# EAGLE design H0FR70 (EAGLE 9.6.1)

## Sheet 1 of 2
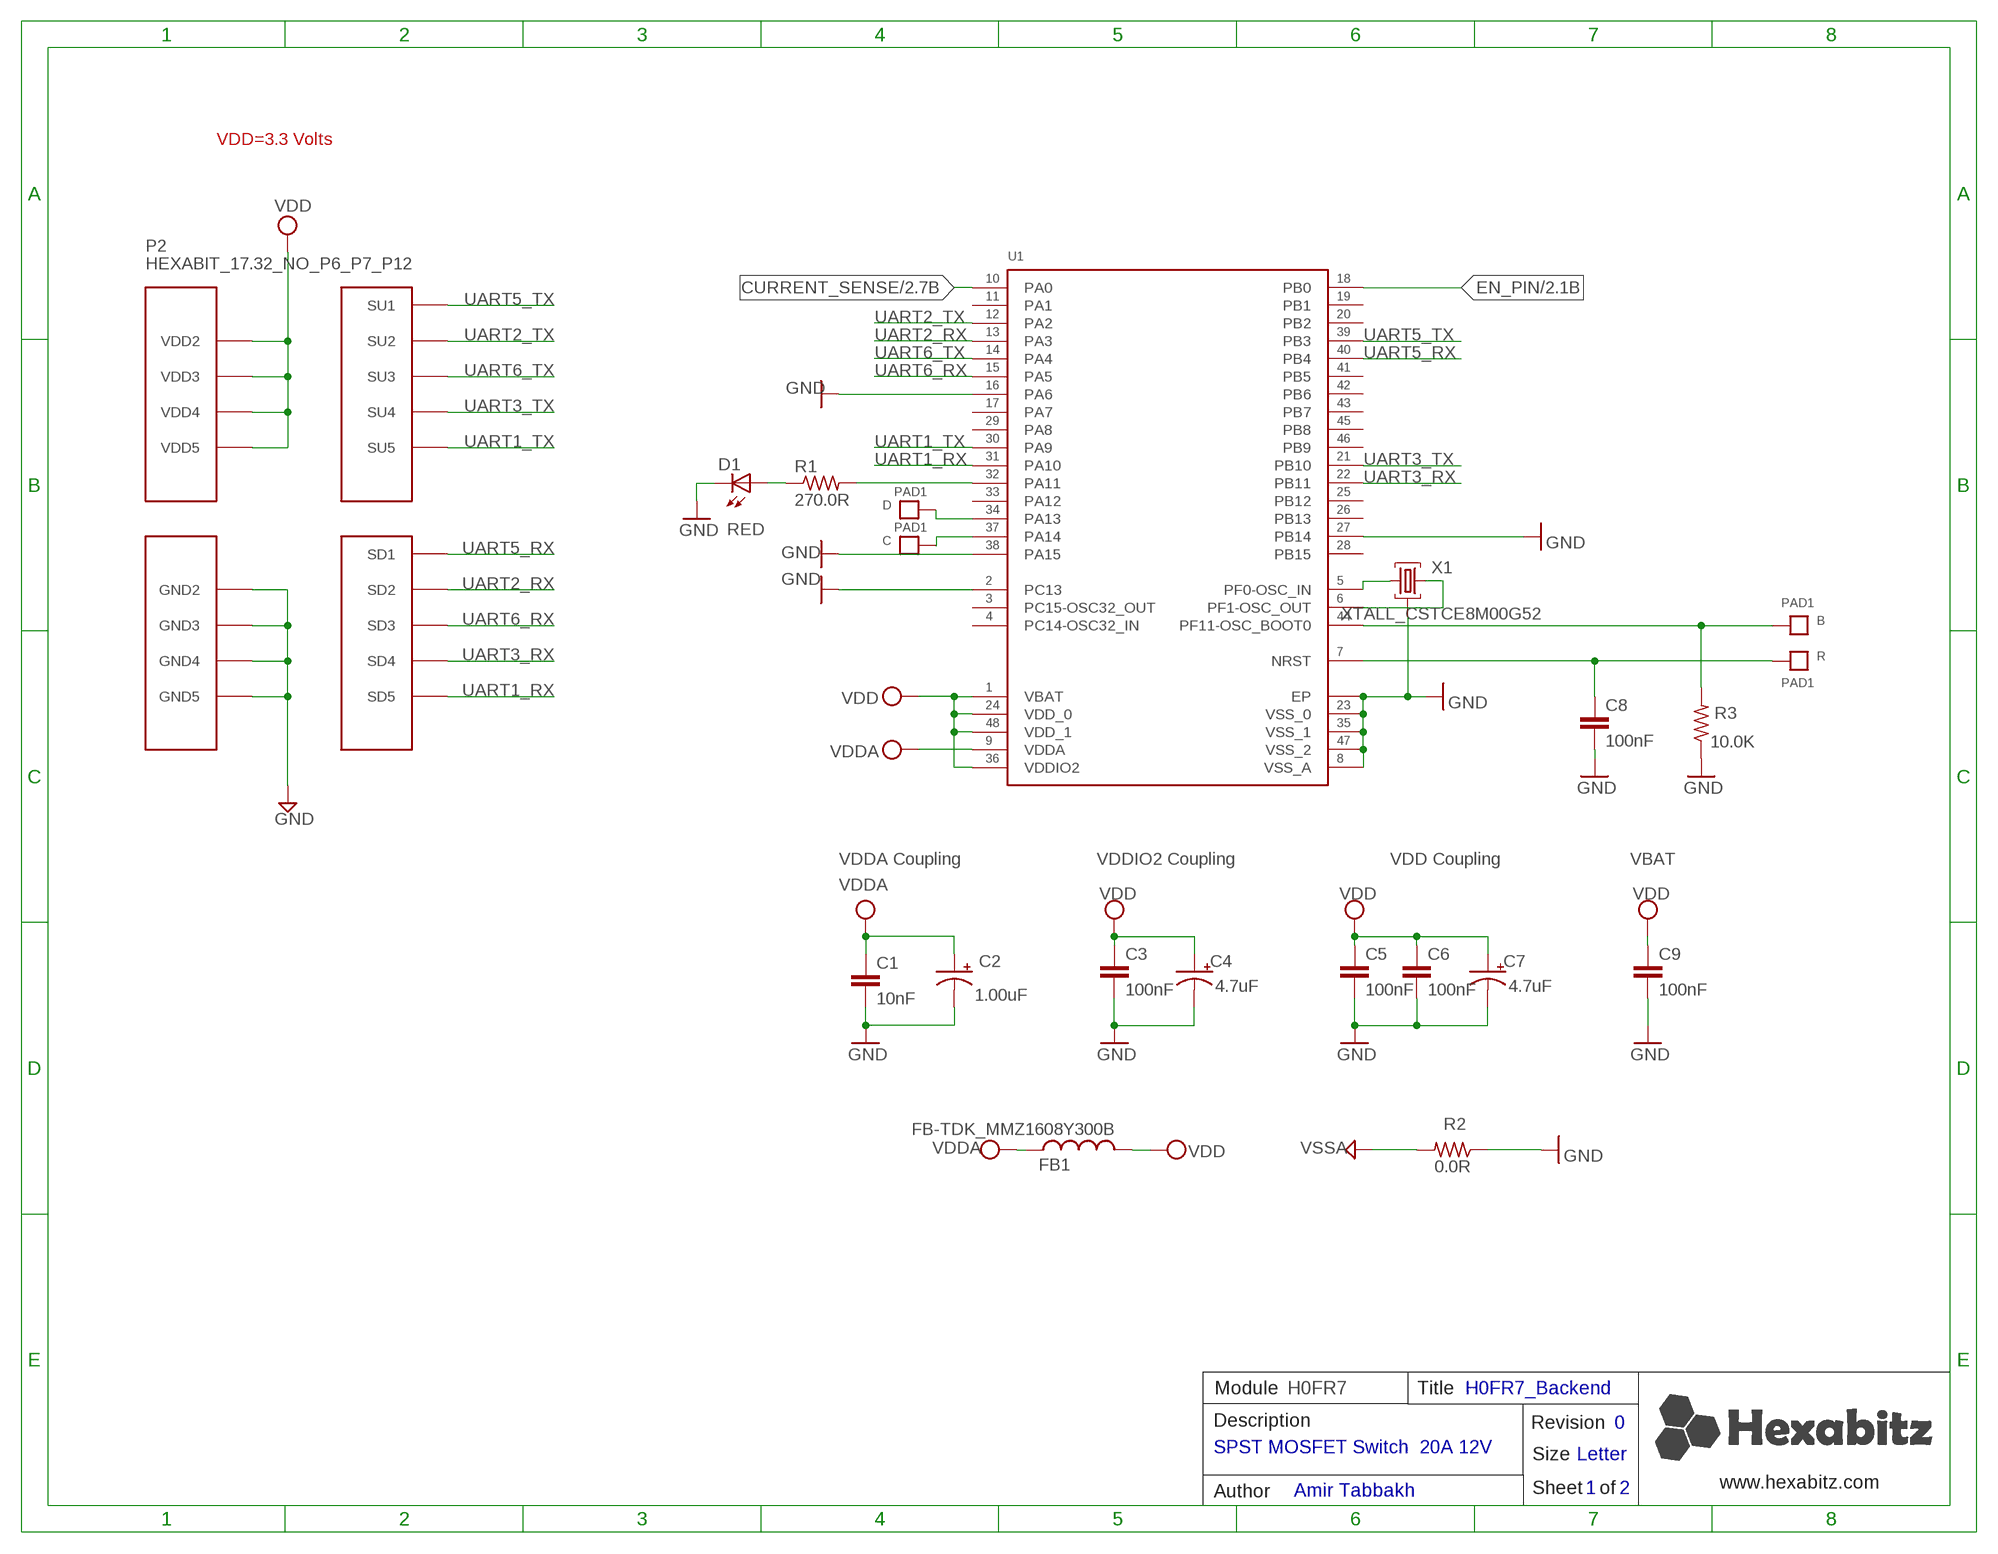
[diagram p0: schematic, sheet 1]

### Parts
B  PAD1  [PAD1]
C  PAD1  [PAD1]
C1  10nF  C-0603  [C-0603]
C2  1.00uF  C-0805-POL  [C-0805-POL]
C3  100nF  C-0603  [C-0603]
C4  4.7uF  C-0805-POL  [C-0805-POL]
C5  100nF  C-0603  [C-0603]
C6  100nF  C-0603  [C-0603]
C7  4.7uF  C-0805-POL  [C-0805-POL]
C8  100nF  C-0603  [C-0603]
C9  100nF  C-0603  [C-0603]
D  PAD1  [PAD1]
D1  RED  VLMS1300-GS08  [VLMS1300-GS08]
FB1  FB-TDK_MMZ1608Y300B  [FB-TDK_MMZ1608Y300B]
P2  HEXABIT_17.32_NO_P6_P7_P12  [HEXABIT_17.32_NO_P6_P7_P12]
R  PAD1  [PAD1]
R1  270.0R  R-0603  [R-0603]
R2  0.0R  R-0603  [R-0603]
R3  10.0K  R-0603  [R-0603]
U1  STM32F091CBU6  [STM32F091CBU6]
X1  XTALL_CSTCE8M00G52  [XTALL_CSTCE8M00G52]

### Nets
AGND: R2.2 ; supply symbol labelled VSSA ; also sheet 2
B1: B.P$1 B.P$2 R3.2 U1.P$44(PF11-OSC_BOOT0)
CURRENT_SENSE: U1.P$10(PA0) ; also sheet 2
EN_PIN: U1.P$18(PB0) ; also sheet 2
GND: C1.2 C2.2(-) C3.2 C4.2(-) C5.2 C6.2 C7.2(-) C8.2 C9.2 D1.C P2.PAD_PD8(GND2) P2.PAD_PD9(GND3) P2.PAD_PD10(GND4) P2.PAD_PD11(GND5) R2.1 R3.1 U1.EP U1.P$2(PC13) U1.P$8(VSS_A) U1.P$16(PA6) U1.P$23(VSS_0) U1.P$27(PB14) U1.P$35(VSS_1) U1.P$38(PA15) U1.P$47(VSS_2) X1.P$2 ; also sheet 2
N$1: D.P$1 D.P$2 U1.P$34(PA13)
N$2: C.P$1 C.P$2 U1.P$37(PA14)
N$3: R1.2 U1.P$32(PA11)
N$4: D1.A R1.1
N$5: U1.P$5(PF0-OSC_IN) X1.P$1
N$6: U1.P$6(PF1-OSC_OUT) X1.P$3
R1: C8.1 R.P$1 R.P$2 U1.P$7(NRST)
UART1_RX: P2.PAD_PD5(SD5) U1.P$31(PA10)
UART1_TX: P2.PAD_PU5(SU5) U1.P$30(PA9)
UART2_RX: P2.PAD_PD2(SD2) U1.P$13(PA3)
UART2_TX: P2.PAD_PU2(SU2) U1.P$12(PA2)
UART3_RX: P2.PAD_PD4(SD4) U1.P$22(PB11)
UART3_TX: P2.PAD_PU4(SU4) U1.P$21(PB10)
UART5_RX: P2.PAD_PD1(SD1) U1.P$40(PB4)
UART5_TX: P2.PAD_PU1(SU1) U1.P$39(PB3)
UART6_RX: P2.PAD_PD3(SD3) U1.P$15(PA5)
UART6_TX: P2.PAD_PU3(SU3) U1.P$14(PA4)
VDD: C3.1 C4.1(+) C5.1 C6.1 C7.1(+) C9.1 FB1.2 P2.PAD_PU8(VDD2) P2.PAD_PU9(VDD3) P2.PAD_PU10(VDD4) P2.PAD_PU11(VDD5) U1.P$1(VBAT) U1.P$24(VDD_0) U1.P$36(VDDIO2) U1.P$48(VDD_1)
VDDA: C1.1 C2.1(+) FB1.1 U1.P$9(VDDA) ; also sheet 2
Unconnected: U1.P$3(PC14-OSC32_IN) U1.P$4(PC15-OSC32_OUT) U1.P$11(PA1) U1.P$17(PA7) U1.P$19(PB1) U1.P$20(PB2) U1.P$25(PB12) U1.P$26(PB13) U1.P$28(PB15) U1.P$29(PA8) U1.P$33(PA12) U1.P$41(PB5) U1.P$42(PB6) U1.P$43(PB7) U1.P$45(PB8) U1.P$46(PB9)

### Notes on the sheet
- VDD=3.3 Volts
- VDDA Coupling | VDDIO2 Coupling | VDD Coupling | VBAT
- Module | H0FR7 | Title | H0FR7_Backend
- Description | Revision | 0
- SPST MOSFET Switch  20A 12V
- Size | Letter
- www.hexabitz.com
- Author | Amir Tabbakh | Sheet   of | 1 | 2
- C:/Users/Admin/Desktop/logodraft.bmp

## Sheet 2 of 2
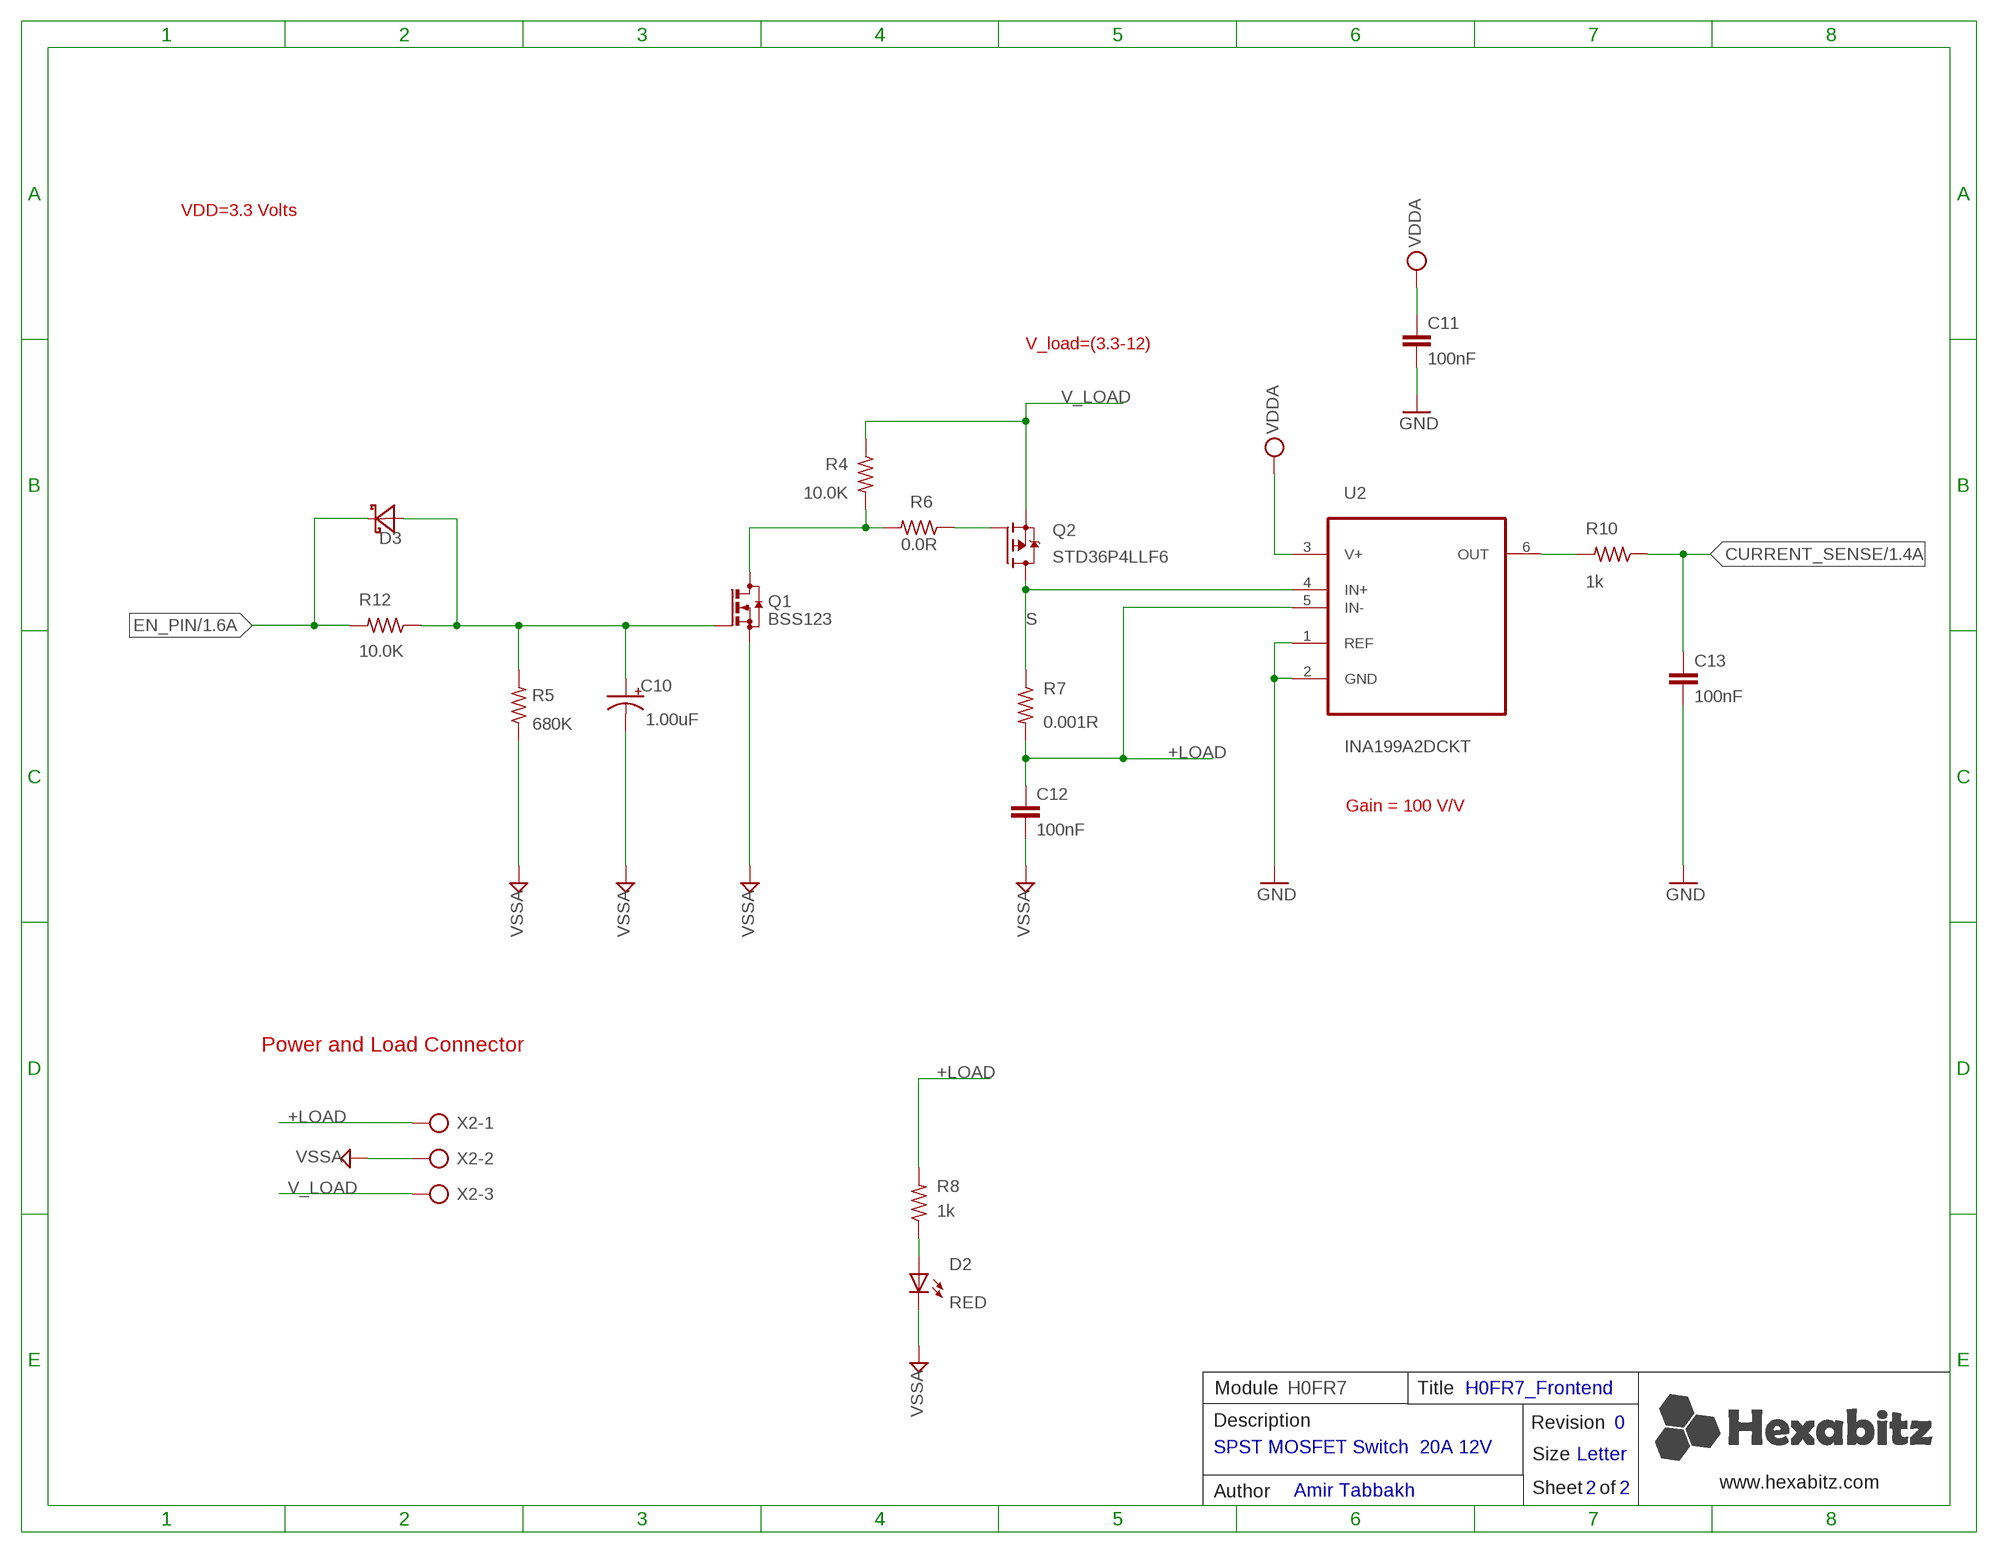
[diagram p1: schematic, sheet 2]

### Parts
C10  1.00uF  C-0805-POL  [C-0805-POL]
C11  100nF  C-0603  [C-0603]
C12  100nF  C-0603  [C-0603]
C13  100nF  C-0603  [C-0603]
D2  RED  VLMS1300-GS08  [VLMS1300-GS08]
D3  SMD-DIODE-SCHOTTKY-40V-300MA(SOD-323)  [SOD-323]
Q1  BSS123  [SOT23]
Q2  STD36P4LLF6  [DPAK-3]
R4  10.0K  R-0603  [R-0603]
R5  680K  R-0603  [R-0603]
R6  0.0R  R-0603  [R-0603]
R7  0.001R  R-US_R2512  [R2512]
R8  1k  R-0603  [R-0603]
R10  1k  R-0603  [R-0603]
R12  10.0K  R-0603  [R-0603]
U2  INA199A2DCKT  [SOT65P210X110-6N]
X2  AK500/3  [AK500/3]

### Nets
+LOAD: C12.1 R7.2 R8.2 U2.5(IN-) X2.1
AGND: C10.2(-) C12.2 D2.C Q1.2(S) R5.1 X2.2 ; supply symbol labelled VSSA ; also sheet 1
CURRENT_SENSE: C13.1 R10.1 ; also sheet 1
EN_PIN: D3.-(C) R12.2 ; also sheet 1
GND: C11.2 C13.2 U2.1(REF) U2.2(GND) ; also sheet 1
N$7: Q1.3(D) R4.2 R6.2
N$8: D2.A R8.1
N$9: R10.2 U2.6(OUT)
N$10: Q2.1(G) R6.1
N$13: C10.1(+) D3.+(A) Q1.1(G) R5.2 R12.1
S: Q2.4(D) R7.1 U2.4(IN+)
V_LOAD: Q2.3(S) R4.1 X2.3
VDDA: C11.1 U2.3(V+) ; also sheet 1

### Notes on the sheet
- VDD=3.3 Volts
- V_load=(3.3-12)
- Gain = 100 V/V
- Power and Load Connector
- Module | H0FR7 | Title | H0FR7_Frontend
- Description | Revision | 0
- SPST MOSFET Switch  20A 12V
- Size | Letter
- www.hexabitz.com
- Author | Amir Tabbakh | Sheet   of | 2 | 2

## Library data of the parts
B C D R = HEXABITZ_CONNECTION_PARTS:PAD1
C1 = HEXABITZ_RCLS:C-0603: CAP CER 10% X7R 0603; CAPACITANCE: 10nF; MFN: KEMET; MPN: C0603C103K5RACTU; OCTOPART_URL: https://octopart.com/c0603c103k5ractu-kemet-133094?r=sp&s=R_iPBxLnSmGqhkU2rIMFpg; TOLERANCE: 10%; VOLTAGE_RATING: 50V
C2 C10 = HEXABITZ_RCLS:C-0805-POL: Cap Tant Solid SMD 2012; CAPACITANCE: 1.00uF; MFN: Yageo; MPN: CC0805KKX7R7BB105; OCTOPART_URL: https://octopart.com/cc0805kkx7r7bb105-yageo-8376555?r=sp&s=YKl1wwtkROau_X5nniH2ig; TOLERANCE: 10%; VOLTAGE_RATING: 16V
C3 C6 C8 C12 C13 = HEXABITZ_RCLS:C-0603: CAP CER 10% X7R 0603; CAPACITANCE: 100nF; MFN: KEMET; MPN: C0603C104K8RACTU; OCTOPART_URL: https://octopart.com/c0603c104k8ractu-kemet-145075?r=sp&s=9bS9ASSwSEqMCE9KBEQZ0g; TOLERANCE: 10%; VOLTAGE_RATING: 10V
C4 C7 = HEXABITZ_RCLS:C-0805-POL: Cap Tant Solid SMD 2012; CAPACITANCE: 4.7uF; MFN: Murata; MPN: GRM21BC81E475KA12L; OCTOPART_URL: https://octopart.com/grm21bc81e475ka12l-murata-10331911?r=sp&s=RY3qZSD8T6mG6TC9CHI5qQ; TOLERANCE: 10%; VOLTAGE_RATING: 25V
C5 = HEXABITZ_RCLS:C-0603: CAP CER 10% X7R 0603; CAPACITANCE: 100nF; MFN: KEMET; MPN: C0603C104K8RACTU; OCTOPART_URL: https://octopart.com/c0603c104k8ractu-kemet-145075?r=sp&s=9bS9ASSwSEqMCE9KBEQZ0g; TOLERANCE: 10%; VOLTAGE_RATING: 10
C9 C11 = HEXABITZ_RCLS:C-0603: CAP CER 10% X7R 0603; CAPACITANCE: 100nF; MFN: KEMET; MPN: C0603C104K8RACTU; OCTOPART_URL: https://octopart.com/c0603c104k8ractu-kemet-145075?r=sp&s=9bS9ASSwSEqMCE9KBEQZ0g; TOLERANCE: 10V; VOLTAGE_RATING: 10%
D1 = HEXABITZ_USER_INTERFACE_PARTS:VLMS1300-GS08: Red 0603 130° Clear 54 mcd 2 V Surface Mount ChipLED ; Octopart Url : http://octopart.com/vlms1300-gs08-vishay-21709201; MFN: Vishay; MPN: VLMS1300-GS08; OCTOPART_URL: https://octopart.com/vlms1300-gs08-vishay-21709201?r=sp&s=_gcP4_q8T1SC6PJQPTQ9yA
D2 = HEXABITZ_USER_INTERFACE_PARTS:VLMS1300-GS08: Red 0603 130° Clear 54 mcd 2 V Surface Mount ChipLED ; Octopart Url : http://octopart.com/vlms1300-gs08-vishay-21709201; MFN: Vishay; MPN: VLMO1300-GS08; OCTOPART_URL: https://octopart.com/vlmo1300-gs08-vishay-21709200?r=sp#
D3 = HEXABITZ_RCLS:SMD-DIODE-SCHOTTKY-40V-300MA(SOD-323): 304020019; AVAILABILITY: Unavailable; DESCRIPTION: Diode Small Signal Schottky 40V 0.3A Automotive 2-Pin SOD-323 T/R; MF: STMicroelectronics; MP: BAT54JFILM; PACKAGE: SOD-323 STMicroelectronics; PRICE: None
FB1 = HEXABITZ_RCLS:FB-TDK_MMZ1608Y300B: Ferrite Beads Multi-Layer 30Ohm 25% 100MHz 1.5A 50mOhm DCR 0603; MFN: TDK; MPN: MMZ1608Y300B; OCTOPART_URL: https://octopart.com/mmz1608y300b-tdk-368280?r=sp&s=cd9_2ZEqQ9q9UNBuQgHAiA
P2 = hexabitz_connectors:HEXABIT_?_NO_P6_P7_P12: Hexabitz Hexagon Module Connector Hexagon side length = 17.32mm. The following ports are removed: P6 P7 P12
Q1 = HEXABITZ_RCLS:BSS123: N-CHANNEL MOS FET; DESCRIPTION: Transistor MOSFET Negative Channel 100 Volt 0.17A 3-Pin SOT-23; MFN: ON Semiconductor; MPN: BSS123; OCTOPART_URL: https://octopart.com/bss123-on+semiconductor-20837328?r=sp
Q2 = HEXABITZ_RCLS:STD36P4LLF6: P-channel 40 V, 0.0175 Ω typ.,36 A, STripFET™ F6 Power MOSFET in a DPAK package; DISCRIPTION: P-channel 40 V, 0.0175 Ohm typ., 36 A STripFET F6 in a DPAK package; MFN: STMicroelectronics; MPN: STD36P4LLF6; OCTOPART_URL: https://octopart.com/std36p4llf6-stmicroelectronics-34425371?r=sp
R1 = HEXABITZ_RCLS:R-0603: Thick Film Resistors - SMD 0603; MFN: Yageo; MPN: RC0603FR-07270RL; OCTOPART_URL: https://octopart.com/search?q=RC0603FR-07270RL&start=0; RESISTANCE: 270.0 Ohm; TOLERANCE: 1%
R2 R6 = HEXABITZ_RCLS:R-0603: Thick Film Resistors - SMD 0603; MFN: Yageo; MPN: RC0603JR-070RL; OCTOPART_URL: https://octopart.com/rc0603jr-070rl-yageo-1241539?r=sp&s=X2NteqRjRNWrnx42Y0aliA; RESISTANCE: 0.0 Ohm
R3 R4 R12 = HEXABITZ_RCLS:R-0603: Thick Film Resistors - SMD 0603; MFN: Yageo; MPN: RC0603JR-0710KL; OCTOPART_URL: https://octopart.com/search?q=RC0603JR-0710KL&start=0; RESISTANCE: 10.0K Ohm; TOLERANCE: 5%
R5 = HEXABITZ_RCLS:R-0603: Thick Film Resistors - SMD 0603; MFN: Yageo; MPN: RC0603JR-07680KL; OCTOPART_URL: https://octopart.com/rc0603jr-07680kl-yageo-40953169?r=sp; RESISTANCE: 680K Ohm; TOLERANCE: 5%
R7 = HEXABITZ_RCLS:R-US_: RESISTOR, American symbol; SPICEPREFIX: R
R8 = HEXABITZ_RCLS:R-0603: Thick Film Resistors - SMD 0603; MFN: Yageo; MPN: RC0603JR-071KL; OCTOPART_URL: https://octopart.com/rc0603jr-071kl-yageo-55402888?r=sp; RESISTANCE: 1k; TOLERANCE: 1%
R10 = HEXABITZ_RCLS:R-0603: Thick Film Resistors - SMD 0603; MFN: Yageo; MPN: RC0603JR-071KL; OCTOPART_URL: https://octopart.com/rc0603jr-071kl-yageo-55402888?r=sp; RESISTANCE: 1k; TOLERANCE: 5%
U1 = HEXABITZ_ICs:STM32F091CBU6: Description : ARM-based 32-bit MCU, CAN, 12 timers, ADC, DAC & Comm. Interface, 2 to 3.6 V, -40 to 85 degC, 48-Pin UFQFPN, RoHS, Tray ;Parameter : Ciiva URL : https://ciiva.com/part/STM32F091CBU6-20240708, CiivaID : 20240708, Clock Speed : 48000000.0 Hz, Lifecycle Status : Active, Mounting Style : Surface Mount, Number of Pins : 48, Octopart Url : https://octopart.com/stm32f091cbu6-stmicroelectronics-51988677, OctopartID : 5f4f955c32ec8088, RAM Memory Size : 32768 B, REACH SVHC Compliance : No SVHC, RoHS : Compliant,; MFN: STMicroelectronics; MPN: STM32F091CBU6; OCTOPART_URL: https://octopart.com/stm32f091cbu6-stmicroelectronics-51988677?r=sp&s=bU6fpgsrTZOxHyt7jkfh3w
U2 = HEXABITZ_ICs:INA199A2DCKT: CURRENT SHUNT MONITOR; DESCRIPTION: 26V, bi-directional current sense amplifier 6-SC70 -40 to 125; MFN: Texas Instruments; MPN: INA199A2DCKT; OCTOPART_URL: https://octopart.com/ina199a2dckt-texas+instruments-18607270?r=sp
X1 = HEXABITZ_OTHER_PARTS:XTALL_CSTCE8M00G52: MURATA CSTCE8M00G52-R0 RESONATOR, SMD, 8MHZ ; Octopart Url : https://octopart.com/cstce8m00g52-r0-murata-7145559; MFN: Murata; MPN: CSTCE8M00G52Z-R0; OCTOPART_URL: https://octopart.com/cstce8m00g52z-r0-murata-17755941?r=sp&s=JDnNJnrHQhyS8Zk4ofFWXw
X2 = HEXABITZ_CONNECTION_PARTS:AK500/3: CONNECTOR; DESCRIPTION: Altech 34.403 PCB Terminal, Front wire, 3 Pole, 10.00mm AK500/03DS-10.0-V, 20A, 300V, grey; MFN: Altech; MPN: AK500/3; OCTOPART_URL: https://octopart.com/30.703-altech-46803?r=sp

## Board
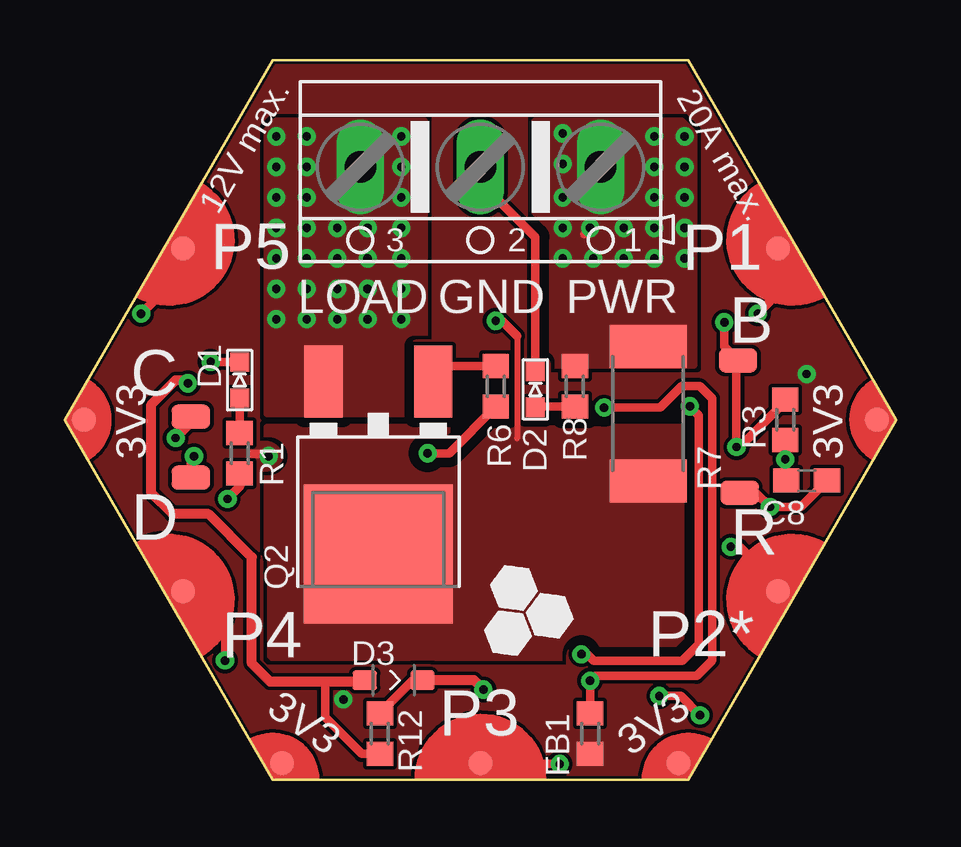
[diagram p2: board, top side]
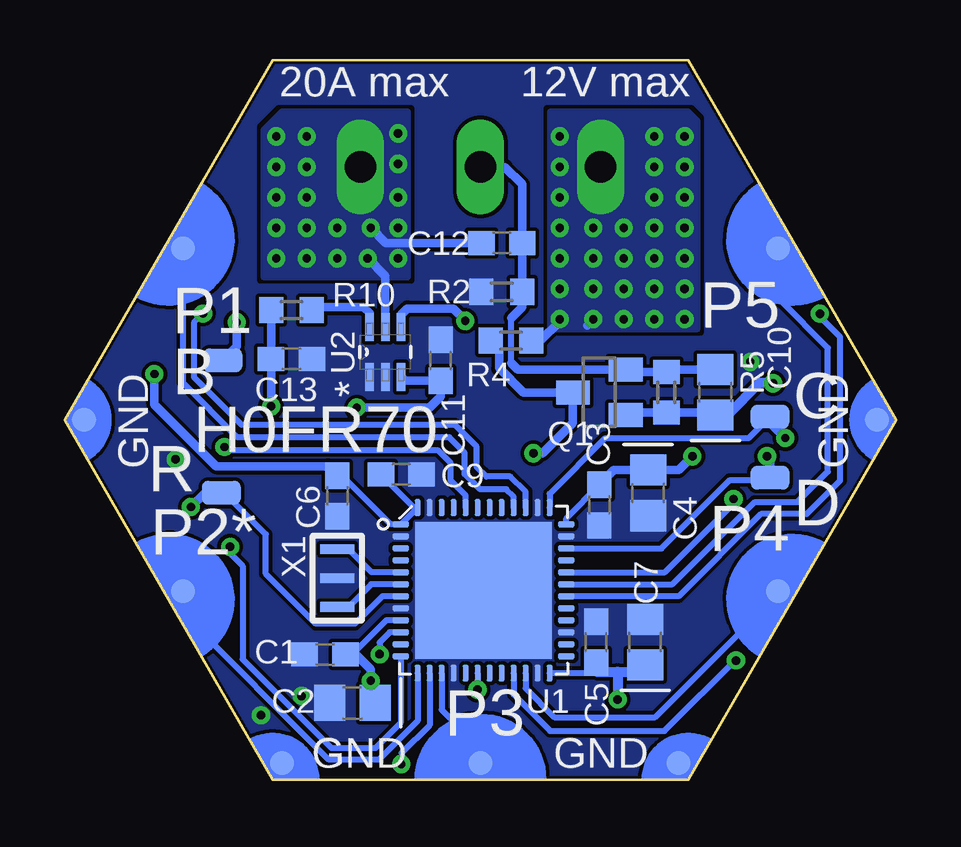
[diagram p3: board, bottom side, seen from below]

Size 34.64 x 30 mm. Coordinates in mm from the lower left corner, seen from the top.
Copper layers (1*16): Top 0.035mm / dielectric 1.5mm / Bottom 0.035mm
Design rules "2_layer *": minimum track width 7mil, minimum drill 10mil, track to track 6mil, track to pad 6mil, pad to pad 6mil, via to via 6mil, smd to smd 0mil, copper to edge 1mil, drill to drill 8mil, minimum pad ring 10mil, minimum via ring 8mil, stop-mask expansion 2mil, vias tented up to drill 15mil, thermal gap 10mil

### Footprints (pad centres in the part's own frame; a part is rotated, then mirrored left to right if it is on the bottom)
PAD1 = smd 1.6 x 1: P$1 0,0 | smd 1.6 x 1 bottom: P$2 0,0
C-0603 = smd 1.1 x 1: 1 -0.85,0; 2 0.85,0
C-0805-POL = smd 1.3 x 1.5: 1 -0.95,0; 2 0.95,0
VLMS1300-GS08 = smd 0.8 x 0.8: A 0,0.75; C 0,-0.75
SOD-323 = smd 1 x 0.8: + -1.2,0; - 1.2,0
FB-TDK_MMZ1608Y300B = smd 1 x 1.1: 1 -0.85,0; 2 0.85,0
HEXABIT_17.32_NO_P6_P7_P12 = smd 1 x 1 bottom: PAD_PD1 12.39,7.15; PAD_PD2 12.39,-7.15; PAD_PD3 0,-14.31; PAD_PD4 -12.39,-7.15; PAD_PD5 -12.39,7.15; PAD_PD8 16.52,0; PAD_PD9 8.26,-14.31; PAD_PD10 -8.26,-14.31; PAD_PD11 -16.52,0 | smd 1 x 1: PAD_PU1 12.39,7.15; PAD_PU2 12.39,-7.15; PAD_PU3 0,-14.31; PAD_PU4 -12.39,-7.15; PAD_PU5 -12.39,7.15; PAD_PU8 16.52,0; PAD_PU9 8.26,-14.31; PAD_PU10 -8.26,-14.31; PAD_PU11 -16.52,0
SOT23 = smd 1 x 1.4: 1 -0.95,-1.1; 2 0.95,-1.1; 3 0,1.1
DPAK-3 = smd 1.6 x 3: 1 -2.286,-7.18; 3 2.286,-7.18 | smd 6.2 x 5.8: 4 0,0
R-0603 = smd 1 x 1.1: 1 -0.85,0; 2 0.85,0
R2512 = smd 1.8 x 3.2: 1 -2.8,0; 2 2.8,0
STM32F091CBU6 = smd 5.7 x 5.7: EP 0,0 | smd 0.25 x 0.7: P$1 -2.75,-3.45; P$2 -2.25,-3.45; P$3 -1.75,-3.45; P$4 -1.25,-3.45; P$5 -0.75,-3.45; P$6 -0.25,-3.45; P$7 0.25,-3.45; P$8 0.75,-3.45; P$9 1.25,-3.45; P$10 1.75,-3.45; P$11 2.25,-3.45; P$12 2.75,-3.45; P$25 2.75,3.45; P$26 2.25,3.45; P$27 1.75,3.45; P$28 1.25,3.45; P$29 0.75,3.45; P$30 0.25,3.45; P$31 -0.25,3.45; P$32 -0.75,3.45; P$33 -1.25,3.45; P$34 -1.75,3.45; P$35 -2.25,3.45; P$36 -2.75,3.45 | smd 0.7 x 0.25: P$13 3.45,-2.75; P$14 3.45,-2.25; P$15 3.45,-1.75; P$16 3.45,-1.25; P$17 3.45,-0.75; P$18 3.45,-0.25; P$19 3.45,0.25; P$20 3.45,0.75; P$21 3.45,1.25; P$22 3.45,1.75; P$23 3.45,2.25; P$24 3.45,2.75; P$37 -3.45,2.75; P$38 -3.45,2.25; P$39 -3.45,1.75; P$40 -3.45,1.25; P$41 -3.45,0.75; P$42 -3.45,0.25; P$43 -3.45,-0.25; P$44 -3.45,-0.75; P$45 -3.45,-1.25; P$46 -3.45,-1.75; P$47 -3.45,-2.25; P$48 -3.45,-2.75
SOT65P210X110-6N = smd 1.168 x 0.356: 1 -1.041,0.66; 2 -1.041,0; 3 -1.041,-0.66; 4 1.041,-0.66; 5 1.041,0; 6 1.041,0.66
XTALL_CSTCE8M00G52 = smd 1.4 x 0.4: P$1 0,1.2; P$2 0,0; P$3 0,-1.2
AK500/3 = drill 1.321 long: 1 -5.004,0; 2 0,0; 3 5.004,0

### Placement (x,y rotation side)
B  28.05,17.48 0 top
C  5.26,15.13 0 top
C1  23.8,5.22 180 bottom
C2  22.65,3.19 180 bottom
C3  12.37,11.44 270 bottom
C4  10.34,11.95 270 bottom
C5  12.49,5.73 90 bottom
C6  23.29,11.82 270 bottom
C7  10.46,5.73 90 bottom
C8  30.91,12.46 180 top
C9  20.62,12.71 0 bottom
C10  7.54,16.14 90 bottom
C11  18.97,17.48 90 bottom
C12  16.43,22.37 0 bottom
C13  25.19,17.54 0 bottom
D  5.26,12.59 180 top
D1  7.29,16.65 180 top
D2  19.61,16.27 180 top
D3  13.7,4.14 0 top
FB1  21.89,1.92 270 top
P2  17.32,15 0 top
Q1  12.37,16.14 90 bottom
Q2  13.07,9.41 180 top
R  28.12,11.95 180 top
R1  7.29,13.6 270 top
R2  16.43,20.33 0 bottom
R3  30.02,15 90 top
R4  16.05,18.3 180 bottom
R5  9.57,16.14 270 bottom
R6  17.95,16.4 270 top
R7  24.3,15.25 90 top
R8  21.26,16.4 90 top
R10  25.19,19.57 0 bottom
R12  13.13,1.92 90 top
U1  17.19,7.89 270 bottom
U2  21.28,17.82 90 bottom
X1  23.29,8.4 0 bottom
X2  17.32,25.54 180 top

### Tracks (layer width: path | path; a pad name or v marks a point on that pad's centre or on a via)
+LOAD  (via drill 0.35)
  Top 0.356: 21.64,22.75 v21.89,23
  Bottom 0.356: v22.02,21.73 21.28,20.99 U2.5 | v21.89,23 21.26,22.37 C12.1
  other vias: 25.83,26.81 23.29,23 23.29,21.73 24.56,21.73 24.56,23 24.56,24.27 24.56,25.54 24.56,26.81 25.83,25.54 25.83,24.27 25.83,23 25.83,21.73 20.75,23 20.75,21.73 20.75,24.27 20.75,25.67 20.75,26.94
  pour Top (isolate 0.406, rank 2, no thermals): 19.61,17.29 26.21,17.29 26.21,26.94 25.7,27.45 19.61,27.45
  pour Bottom (isolate 0.406, rank 2, no thermals): 20.37,20.97 26.34,20.97 26.34,27.06 25.58,27.83 20.37,27.83
AGND
  Top 0.356: X2.2 17.32,24.91 19.61,22.62 D2.C
  Bottom 0.254: 16.03,17.36 16.03,19.24
  Bottom 0.356: X2.2 16.3,25.54 15.58,24.82 C12.2 R2.2 15.58,19.69 16.03,19.24 | C10.2 9.47,17.09 R5.1 11.17,16.99 Q1.2 15.76,17.09 16.03,17.36
B1  (via drill 0.35)
  Top 0.356: R3.2 30.02,15.77 28.12,13.86 v27.99,13.86 27.99,17.41 B.P$1 27.48,18.05 v27.48,19.06
  Bottom 0.254: U1.P$44 17.94,11.85 18.58,12.48 18.58,13.21 19.1,13.74 27.86,13.74 v27.99,13.86
  Bottom 0.356: v27.48,19.06 27.48,18.05 B.P$1
CURRENT_SENSE  (via drill 0.35)
  Top 0.356: v21.52,5.22 21.77,5.22 22.03,4.96 25.73,4.96 26.42,5.64 26.42,15.18 v26.04,15.56
  Bottom 0.254: U1.P$10 21.1,6.14 21.52,5.72 v21.52,5.22
  Bottom 0.356: R10.1 C13.1 | C13.1 | v26.04,15.56 C13.1
EN_PIN  (via drill 0.35)
  Top 0.356: D3.- 14.5,4.14 R12.2
  Top 0.406: v17.44,3.75 v17.44,3.76 17.06,4.14 D3.-
  Bottom 0.254: U1.P$18 v17.44,3.75
GND  (via drill 0.35)
  Top 0.356: D1.C 7.28,17.41 v6.08,17.41 | v26.46,2.68 25.66,3.48 v24.77,3.48 | R3.1 v30.02,13.35 30.02,12.5 C8.2
  pour Bottom (isolate 0.102, rank 3, no thermals): 8.61,-0.05 25.93,-0.05 34.59,14.95 25.93,29.95 8.61,29.95 -0.05,14.95
N$1  (via drill 0.35)
  Top 0.356: v5.38,13.48 5.26,13.35 D.P$2
  Bottom 0.254: U1.P$34 13.73,9.63 9.78,9.63 6.92,12.48 5.36,12.48 D.P$2
  Bottom 0.356: v5.38,13.48 5.26,13.35 D.P$2
N$2  (via drill 0.35)
  Top 0.356: v4.62,14.24 5.26,14.87 C.P$2
  Bottom 0.254: C.P$2 6.14,14.24 12.11,14.24 14.44,11.91 U1.P$37
  Bottom 0.356: C.P$2 5.26,14.87 v4.62,14.24
N$3  (via drill 0.35)
  Top 0.356: R1.2 7.31,12.23 v6.78,11.7
  Bottom 0.254: v6.78,11.7 6.78,11.49 9.63,8.64 U1.P$32 | U1.P$32
N$4
  Top 0.356: R1.1 D1.A
N$5
  Bottom 0.254: X1.P$1 22.81,9.6 21.86,8.64 U1.P$5
N$6
  Bottom 0.254: X1.P$3 22.81,7.2 21.87,8.14 U1.P$6
N$7  (via drill 0.35)
  Top 0.356: v15.12,13.6 16.01,13.6 R6.2
  Bottom 0.356: v15.12,13.6 14.74,13.6 13.47,14.87 Q1.3 15.53,16.14 16.54,17.15 16.54,17.94 R4.2
N$8
  Top 0.356: D2.A 19.65,15.54 R8.1
N$9
  Bottom 0.356: R10.2 24.22,19.7 22.2,19.7 21.94,19.45 U2.6
N$10
  Top 0.356: Q2.1 16.01,17.25 R6.1
N$13  (via drill 0.35)
  Top 0.356: 10.84,4.08 10.84,2.59 12.37,1.07 R12.1
  Top 0.406: D3.+ 12.44,4.08 10.84,4.08 8.56,4.08 7.8,4.84 7.8,9.26 6,11.06 4.49,11.06 3.6,11.95 3.6,15.63 4.62,16.65 5,16.65 v5.13,16.52
  Bottom 0.356: C10.1 7.64,15.29 R5.2 11.17,15.29 Q1.1
  Bottom 0.406: v5.13,16.52 5.7,16.52 7.03,15.2 C10.1
R1  (via drill 0.35)
  Top 0.356: R.P$1 28.8,11.95 v29.38,11.37 30.66,11.37 C8.1
  Bottom 0.254: U1.P$7 21.41,7.64 22.55,6.49 24.18,6.49 26.26,8.57 26.26,10.23 27.99,11.95 R.P$1
  Bottom 0.356: v29.38,11.37 28.8,11.95 R.P$1
S  (via drill 0.35)
  Top 0.254: 18.84,18.49 18.84,14.24
  Top 0.356: 18.84,18.49 18.21,19.13 v17.95,19.13
  Bottom 0.356: U2.4 20.62,19.38 20.37,19.63 18.46,19.63 v17.95,19.13
  pour Top (isolate 0.406, rank 2, no thermals): 8.43,14.68 26.21,14.68 26.21,5.09 8.43,5.09
UART1_RX
  Bottom 0.254: U1.P$31 9.32,8.14 5.89,11.57 4.11,11.57 2.84,12.84 2.84,17.99 4.84,19.99
  Bottom 0.305: 4.84,19.99 4.84,22.06 P2.PAD_PD5
UART1_TX  (via drill 0.35)
  Top 0.254: P2.PAD_PU5 4.93,22.24 4.88,22.29
  Top 0.305: 4.88,22.29 4.88,21.48
  Top 0.356: v3.18,19.42 4.88,21.13 4.88,21.48
  Bottom 0.254: U1.P$30 9.06,7.64 5.64,11.06 3.73,11.06 2.33,12.46 2.33,18.45 3.18,19.3 v3.18,19.42
UART2_RX
  Bottom 0.254: U1.P$13 19.94,2.44 21.55,0.83 23.63,0.83 29.71,6.91 P2.PAD_PD2
UART2_TX  (via drill 0.35)
  Top 0.254: 29.71,8.12 P2.PAD_PU2
  Top 0.356: 29.71,8.12 28.78,9.06 28.13,9.7 v27.75,9.7
  Bottom 0.254: U1.P$12 20.64,2.36 21.7,1.3 23.52,1.3 27.23,5.01 27.23,8.9 27.75,9.43 v27.75,9.7
UART3_RX
  Bottom 0.254: U1.P$22 15.44,3.8 14.24,2.6 10.04,2.6 6.59,6.05 6.59,6.19 P2.PAD_PD4
UART3_TX  (via drill 0.35)
  Top 0.356: v6.68,4.96 6.68,6.1 P2.PAD_PU4
  Bottom 0.254: U1.P$21 15.94,3.55 14.42,2.03 9.65,2.03 6.59,5.09 6.53,5.09 6.66,4.95 v6.68,4.96
UART5_RX
  Bottom 0.254: U1.P$40 15.94,11.8 16.24,12.09 17.34,12.09 17.98,12.73 17.98,13.62 18.62,14.27 27.45,14.27 29.71,16.53 P2.PAD_PD1
UART5_TX  (via drill 0.35)
  Top 0.254: 29.39,19.94 29.39,21.83 P2.PAD_PU1
  Top 0.356: v28.88,19.43 29.39,19.94
  Bottom 0.254: v28.88,19.43 29.26,19.05 29.26,16.78 27.28,14.8 18.39,14.8 17.48,13.88 17.48,13.04 17.07,12.63 16.07,12.63 15.44,12 U1.P$39
UART6_RX
  Bottom 0.254: U1.P$15 18.94,2.91 17.32,1.28 P2.PAD_PD3
UART6_TX  (via drill 0.35)
  Top 0.356: v20.62,0.65 17.36,0.65 P2.PAD_PU3
  Bottom 0.254: U1.P$14 19.44,2.27 20.6,1.11 20.6,0.67 v20.62,0.65
V_LOAD  (via drill 0.35)
  Bottom 0.356: v12.62,19.19 12.88,18.94 | v14.02,19.19 14.02,19.1 14.82,18.3 R4.1
  other vias: 8.81,19.19 8.81,20.46 8.81,21.73 8.81,23 8.81,24.27 8.81,25.54 8.81,26.81 10.08,23 10.08,24.27 10.08,25.54 10.08,26.81 11.35,23 12.62,20.46 12.62,21.73 12.62,23 10.08,21.73 11.35,21.73 10.08,20.46 11.35,20.46 11.35,19.19 10.08,19.19 14.02,26.81 14.02,25.54 14.02,24.27 14.02,23 14.02,21.73 14.02,20.46
  pour Top (isolate 0.406, rank 2, no thermals): 14.97,27.45 8.81,27.45 8.43,27.06 8.43,15.25 14.97,15.25
  pour Bottom (isolate 0.406, rank 2, no thermals): 14.4,18.81 8.3,18.81 8.3,27.45 8.68,27.83 14.4,27.83
VDD  (via drill 0.35)
  Top 0.356: v8.49,13.48 8.38,13.58 7.8,13.58
  Bottom 0.254: C5.1 12.94,4.44 U1.P$24 | C7.1 10.74,4.5 | C9.1 20.1,11.34 U1.P$48 U1.P$1 21.06,10.64 23.08,12.67 C6.1 | U1.P$36 13.74,10.89 12.34,12.29 C3.1
  Bottom 0.356: C3.1 11.76,12.9 C4.1 9.07,12.9 v8.49,13.48 | v30.91,16.91 30.91,15.63 28.33,13.06 23.67,13.06 C6.1
  Bottom 0.406: 11.61,4.5 12.49,4.5 C5.1 | 11.61,4.5 10.74,4.5 | 11.61,4.5 v11.61,3.34
  pour Top (isolate 0.102, rank 3, no thermals): 8.61,-0.05 25.93,-0.05 34.59,14.95 25.93,29.95 8.61,29.95 -0.05,14.95
VDDA  (via drill 0.35)
  Top 0.356: FB1.1 v21.89,4.12 22.09,4.32 26.33,4.32 26.97,4.97 26.97,15.89 26.46,16.4 25.7,16.4 24.81,15.51 v22.47,15.51
  Bottom 0.254: 22.65,5.22 21.24,6.64 U1.P$9
  Bottom 0.356: C2.1 21.89,3.38 v21.89,4.12 21.89,4.59 22.53,5.22 22.65,5.22 C1.1 | v22.47,15.51 19.43,15.51 18.97,15.96 C11.1 20.47,16.63 U2.3

### Text on the board
tPlace: 12V max. | 20A max. | P5 | P1 | LOAD | GND | PWR | 3V3 | 3V3 | P4 | P2* | 3V3 | P3 | 3V3
bPlace: 12V max | 20A max | P5 | P1 | GND | GND | H0FR70 | P4 | P2* | P3 | GND | GND
bNames: B | C | R | D
tDocu: Note: This module should be manufactured with 2oz copper to handle 20A current.